# EAGLE schematic cabinet_temp_regulator (EAGLE 9.6.2)
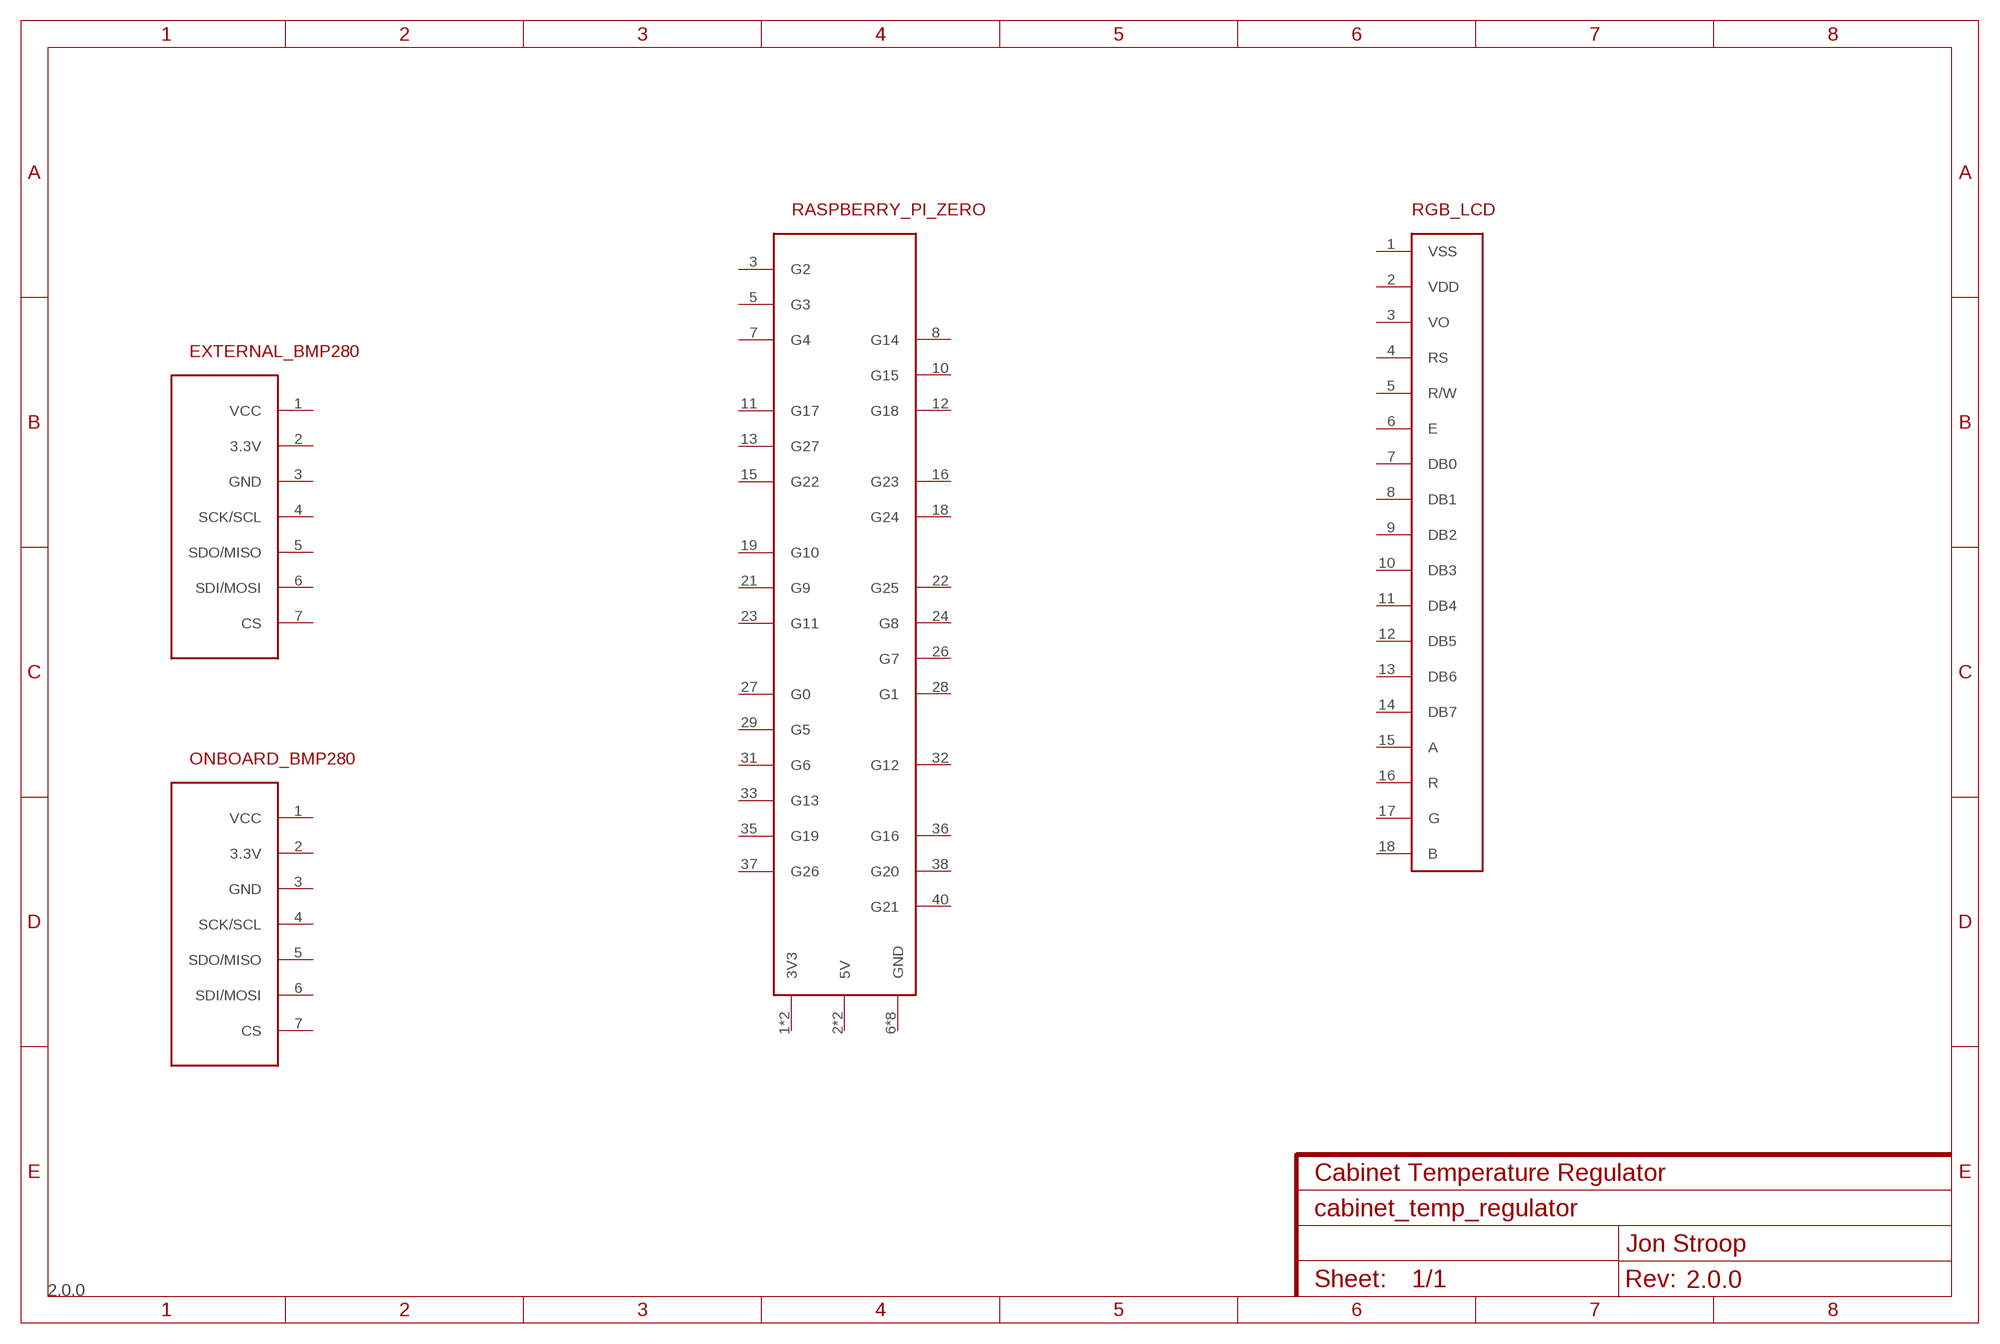
[diagram p0: schematic, sheet 1]
FRAME1 (FRAME-A4L): CNAME: Cabinet Temperature Regulator; CREVISION: 2.0.0; DESIGNER: Jon Stroop; REV: 2.0.0

## Parts
EXTERNAL_BMP280  ADAFRUIT-BMP280-STEMMA-QTADAFRUIT-BMP280-STEMMA-QT-HEADER  [ADAFRUIT-BMP280-STEMMA-QT-HEADER]
ONBOARD_BMP280  ADAFRUIT-BMP280-STEMMA-QT  [ADAFRUIT-BMP280-STEMMA-QT-FULL_FOOTPRINT]
RASPBERRY_PI_ZERO  RASPBERRY_PI_ZERO  [RASPBERRY_PI_ZERO]
RGB_LCD  ADAFRUIT-20X4-RGB-LCD  [ADAFRUIT-20X4-RGB-LCD]
Unconnected: EXTERNAL_BMP280.4(SCK/SCL) EXTERNAL_BMP280.5(SDO/MISO) EXTERNAL_BMP280.6(SDI/MOSI) EXTERNAL_BMP280.7(CS) ONBOARD_BMP280.4(SCK/SCL) ONBOARD_BMP280.5(SDO/MISO) ONBOARD_BMP280.6(SDI/MOSI) ONBOARD_BMP280.7(CS) RASPBERRY_PI_ZERO.3(G2) RASPBERRY_PI_ZERO.5(G3) RASPBERRY_PI_ZERO.7(G4) RASPBERRY_PI_ZERO.8(G14) RASPBERRY_PI_ZERO.10(G15) RASPBERRY_PI_ZERO.11(G17) RASPBERRY_PI_ZERO.12(G18) RASPBERRY_PI_ZERO.13(G27) RASPBERRY_PI_ZERO.15(G22) RASPBERRY_PI_ZERO.16(G23) RASPBERRY_PI_ZERO.18(G24) RASPBERRY_PI_ZERO.19(G10) RASPBERRY_PI_ZERO.21(G9) RASPBERRY_PI_ZERO.22(G25) RASPBERRY_PI_ZERO.23(G11) RASPBERRY_PI_ZERO.24(G8) RASPBERRY_PI_ZERO.26(G7) RASPBERRY_PI_ZERO.27(G0) RASPBERRY_PI_ZERO.28(G1) RASPBERRY_PI_ZERO.29(G5) RASPBERRY_PI_ZERO.31(G6) RASPBERRY_PI_ZERO.32(G12) RASPBERRY_PI_ZERO.33(G13) RASPBERRY_PI_ZERO.35(G19) RASPBERRY_PI_ZERO.36(G16) RASPBERRY_PI_ZERO.37(G26) RASPBERRY_PI_ZERO.38(G20) RASPBERRY_PI_ZERO.40(G21) RGB_LCD.3(VO) RGB_LCD.4(RS) RGB_LCD.6(E) RGB_LCD.7(DB0) RGB_LCD.8(DB1) RGB_LCD.9(DB2) RGB_LCD.10(DB3) RGB_LCD.11(DB4) RGB_LCD.12(DB5) RGB_LCD.13(DB6) RGB_LCD.14(DB7) RGB_LCD.16(R) RGB_LCD.17(G) RGB_LCD.18(B)

## Power pins joined to a net without a drawn wire
3.3V: EXTERNAL_BMP280.2(3.3V) ONBOARD_BMP280.2(3.3V)
3V3: RASPBERRY_PI_ZERO.1(3V3) RASPBERRY_PI_ZERO.17(3V3)
5V: RASPBERRY_PI_ZERO.2(5V) RASPBERRY_PI_ZERO.4(5V)
A: RGB_LCD.15(A)
GND: EXTERNAL_BMP280.3(GND) ONBOARD_BMP280.3(GND) RASPBERRY_PI_ZERO.6(GND) RASPBERRY_PI_ZERO.9(GND) RASPBERRY_PI_ZERO.14(GND) RASPBERRY_PI_ZERO.20(GND) RASPBERRY_PI_ZERO.25(GND) RASPBERRY_PI_ZERO.30(GND) RASPBERRY_PI_ZERO.34(GND) RASPBERRY_PI_ZERO.39(GND)
R/W: RGB_LCD.5(R/W)
VCC: EXTERNAL_BMP280.1(VCC) ONBOARD_BMP280.1(VCC)
VDD: RGB_LCD.2(VDD)
VSS: RGB_LCD.1(VSS)

## Library data of the parts
EXTERNAL_BMP280 ONBOARD_BMP280 = cabinet_temp_regulator:ADAFRUIT-BMP280-STEMMA-QT
RASPBERRY_PI_ZERO = cabinet_temp_regulator:RASPBERRY_PI_ZERO: Raspberry Pi Zero: https://www.raspberrypi.org/products/raspberry-pi-zero/
RGB_LCD = cabinet_temp_regulator:ADAFRUIT-20X4-RGB-LCD